# Altium schematic sheet TERM.SchDoc
size A; SheetNumber: 11; SheetTotal: 11
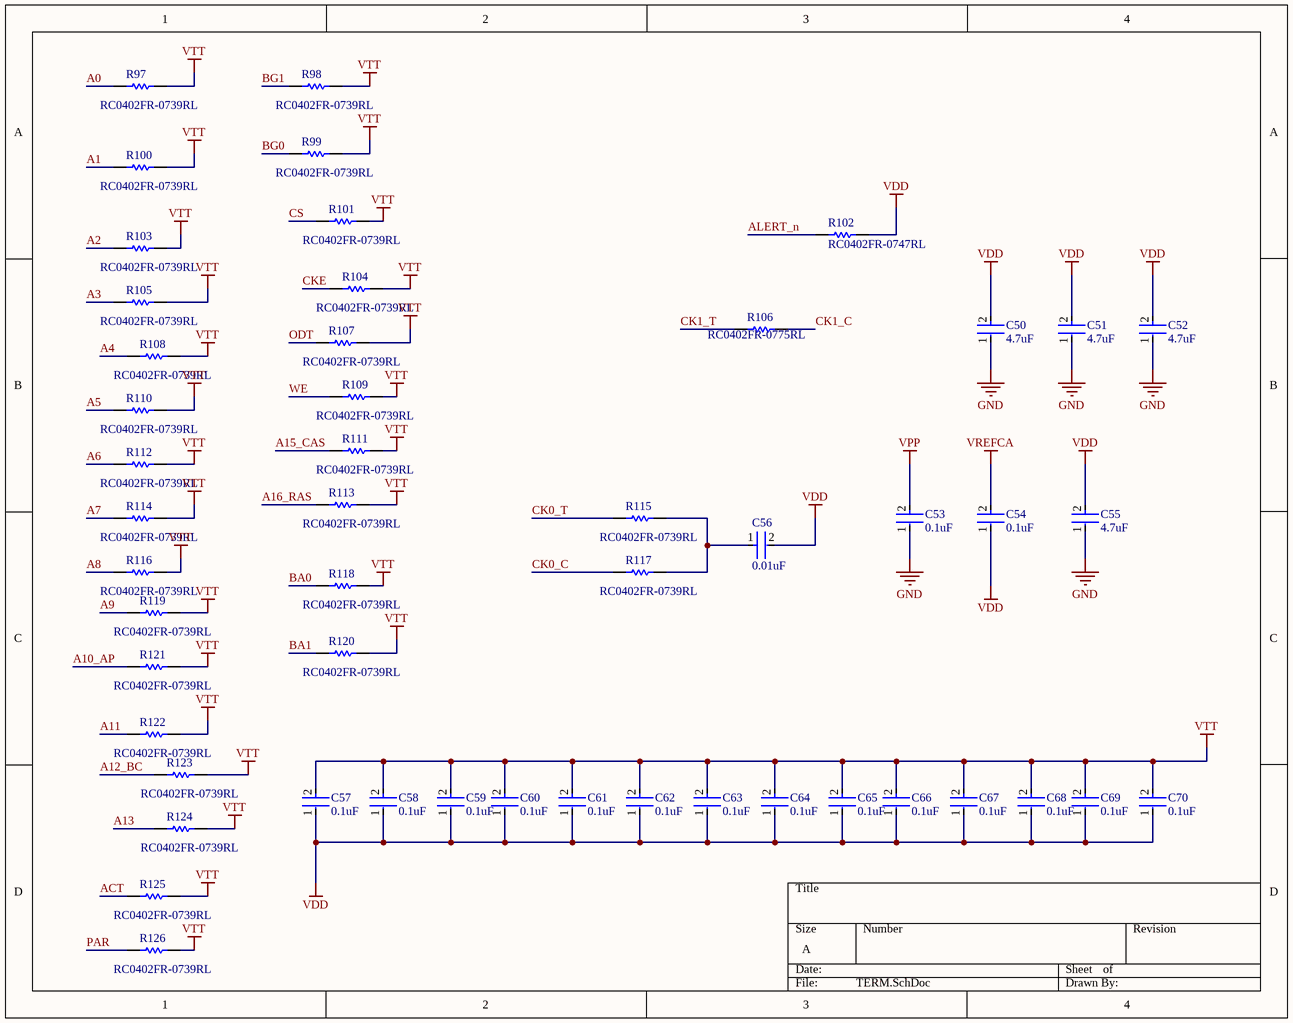
[diagram p0: TERM.SchDoc]

## Parts
C50  4.7uF  [FP-C1608-080-0_1-IPC_C]
C51  4.7uF  [FP-C1608-080-0_1-IPC_C]
C52  4.7uF  [FP-C1608-080-0_1-IPC_C]
C53  0.1uF  [FP-GRM15-MFG]
C54  0.1uF  [FP-GRM15-MFG]
C55  4.7uF  [FP-C1608-080-0_1-IPC_C]
C56  0.01uF  [FP-GRM155-0_05-IPC_C]
C57  0.1uF  [FP-GRM15-MFG]
C58  0.1uF  [FP-GRM15-MFG]
C59  0.1uF  [FP-GRM15-MFG]
C60  0.1uF  [FP-GRM15-MFG]
C61  0.1uF  [FP-GRM15-MFG]
C62  0.1uF  [FP-GRM15-MFG]
C63  0.1uF  [FP-GRM15-MFG]
C64  0.1uF  [FP-GRM15-MFG]
C65  0.1uF  [FP-GRM15-MFG]
C66  0.1uF  [FP-GRM15-MFG]
C67  0.1uF  [FP-GRM15-MFG]
C68  0.1uF  [FP-GRM15-MFG]
C69  0.1uF  [FP-GRM15-MFG]
C70  0.1uF  [FP-GRM15-MFG]
R97  RC0402FR-0739RL  [RESC1005X40X25LL05T10]
R98  RC0402FR-0739RL  [RESC1005X40X25LL05T10]
R99  RC0402FR-0739RL  [RESC1005X40X25LL05T10]
R100  RC0402FR-0739RL  [RESC1005X40X25LL05T10]
R101  RC0402FR-0739RL  [RESC1005X40X25LL05T10]
R102  RC0402FR-0747RL  [RESC1005X40X25LL05T10]
R103  RC0402FR-0739RL  [RESC1005X40X25LL05T10]
R104  RC0402FR-0739RL  [RESC1005X40X25LL05T10]
R105  RC0402FR-0739RL  [RESC1005X40X25LL05T10]
R106  RC0402FR-0775RL  [RESC1005X40X25LL05T10]
R107  RC0402FR-0739RL  [RESC1005X40X25LL05T10]
R108  RC0402FR-0739RL  [RESC1005X40X25LL05T10]
R109  RC0402FR-0739RL  [RESC1005X40X25LL05T10]
R110  RC0402FR-0739RL  [RESC1005X40X25LL05T10]
R111  RC0402FR-0739RL  [RESC1005X40X25LL05T10]
R112  RC0402FR-0739RL  [RESC1005X40X25LL05T10]
R113  RC0402FR-0739RL  [RESC1005X40X25LL05T10]
R114  RC0402FR-0739RL  [RESC1005X40X25LL05T10]
R115  RC0402FR-0739RL  [RESC1005X40X25LL05T10]
R116  RC0402FR-0739RL  [RESC1005X40X25LL05T10]
R117  RC0402FR-0739RL  [RESC1005X40X25LL05T10]
R118  RC0402FR-0739RL  [RESC1005X40X25LL05T10]
R119  RC0402FR-0739RL  [RESC1005X40X25LL05T10]
R120  RC0402FR-0739RL  [RESC1005X40X25LL05T10]
R121  RC0402FR-0739RL  [RESC1005X40X25LL05T10]
R122  RC0402FR-0739RL  [RESC1005X40X25LL05T10]
R123  RC0402FR-0739RL  [RESC1005X40X25LL05T10]
R124  RC0402FR-0739RL  [RESC1005X40X25LL05T10]
R125  RC0402FR-0739RL  [RESC1005X40X25LL05T10]
R126  RC0402FR-0739RL  [RESC1005X40X25LL05T10]

## Nets
GND: C50.1 C51.1 C52.1 C53.1 C55.1
VDD: C50.2 C51.2 C52.2 C54.1 C55.2 C56.2 C57.1 C58.1 C59.1 C60.1 C61.1 C62.1 C63.1 C64.1 C65.1 C66.1 C67.1 C68.1 C69.1 C70.1 R102.2
VPP: C53.2
VREFCA: C54.2
VTT: C57.2 C58.2 C59.2 C60.2 C61.2 C62.2 C63.2 C64.2 C65.2 C66.2 C67.2 C68.2 C69.2 C70.2 R97.2 R98.2 R99.2 R100.2 R101.2 R103.2 R104.2 R105.2 R107.2 R108.2 R109.2 R110.2 R111.2 R112.2 R113.2 R114.2 R116.2 R118.2 R119.2 R120.2 R121.2 R122.2 R123.2 R124.2 R125.2 R126.2
A0: R97.1
A1: R100.1
A2: R103.1
A3: R105.1
A4: R108.1
A5: R110.1
A6: R112.1
A7: R114.1
A8: R116.1
A9: R119.1
A10_AP: R121.1
A11: R122.1
A12_BC: R123.1
A13: R124.1
A15_CAS: R111.1
A16_RAS: R113.1
ACT: R125.1
ALERT_n: R102.1
BA0: R118.1
BA1: R120.1
BG0: R99.1
BG1: R98.1
CK0_C: R117.1
CK0_T: R115.1
CK1_C: R106.2
CK1_T: R106.1
CKE: R104.1
CS: R101.1
ODT: R107.1
PAR: R126.1
WE: R109.1
NetC56_1: C56.1 R115.2 R117.2

## Library data of the parts
C50-C52 C55 = CMP-2000-04981-2: Multilayer Ceramic Capacitors 4.7μF ±10% 16V X5R SMD 0603; Tolerance: 10%; Thickness: 0.035inch; Length: 1.6mm; Width: 0.031inch; Height: 0.8mm; Package Quantity: 1; Voltage: 16V; Construction: Flat; Weight: 7.1E-05oz; Depth: 0.8mm; Case Code (Metric): 1608; Series: C; Lead Free: Lead Free; Voltage Rating: 16V; Voltage Rating (DC): 16V; Capacitance: 4.7uF; Termination: SMD/SMT; Dielectric: X5R; REACH SVHC: No SVHC; RoHS Compliant: Yes; Case Code (Imperial): 0603; Case/Package: 0603; Mount: Surface Mount; Dielectric Material: Ceramic; Packaging: Tape and Reel; Min Operating Temperature: -55°C; Max Operating Temperature: 85°C
C53 C54 C57-C70 = CMP-2100-03641-2: CAP CER 0.1UF 16V X7R 0402; Manufacturer Part Number: GRM155R71C104KA88D; Manufacturer: Murata; Standoff Height: 0mm; Tolerance: 10%; Voltage Rating: 16Vdc; Material: Ceramic; Capacitance: 0.10μF; Value: 0.10μF; RoHS: TRUE; Temperature Characteristic: X7R; Octopart: https://octopart.com/grm155r71c104ka88d-murata-196880; Digikey Description: CAP CER 0.1UF 16V X7R 0402; Device Class L3: Ceramic Capacitors; Height: 0.55mm; ComponentLink2Description: Datasheet; Temperature Range Low: -55°C; Ipc Land Pattern Name: CAPC10050X219; ComponentLink2URL: https://search.murata.co.jp/Ceramy/image/img/A01X/G101/ENG/GRM155R71H471KA01-01A.pdf; Device Class L1: Passive Components; Lead Free: yes; Category: Cap; Package: GRM15; Temperature: -55°C to +125°C; Device Class L2: Capacitors; Temperature Range High: +125°C; Mouser Description: 0402 0.1 uF 16V ±10 % Tolerance X7R SMT Multilayer Ceramic Capacitor
C56 = CMP-2008-04637-5: Chip Multilayer Ceramic Capacitors for General Purpose, 0402, 10000pF, X7R, 15%, 10%, 50V; Voltage: 25V; Capacitance: 10nF; Tolerance: 10%; Mount: Surface Mount; Lead Free: Lead Free; Radiation Hardening: No; Case Code (Imperial): 0402; REACH SVHC: No SVHC; Case/Package: 0402; Dielectric: X7R; Voltage Rating (DC): 50V; Max Operating Temperature: 125°C; Termination: SMD/SMT; Material: Ceramic; Width: 0.02inch; Package Quantity: 1; Voltage Rating: 50V; Thickness: 0.022inch; Packaging: Tape and Reel; Height: 0.5mm; Number of Pins: 2; Case Code (Metric): 1005; Min Operating Temperature: -55°C; Length: 1mm; Depth: 0.5mm
R97-R101 R103-R105 R107-R126 = CMP-1011-00350-2: Manufacturer: Yageo / Phycomp; Part Number: RC0402FR-0739RL
R102 = CMP-2002-07703-1: Manufacturer: Yageo / Phycomp; Part Number: RC0402FR-0747RL
R106 = CMP-2002-07798-1: Manufacturer: Yageo / Phycomp; Part Number: RC0402FR-0775RL